# EAGLE design BEP31_Test_Interface4 (EAGLE 6.4)

## Sheet 1 of 5
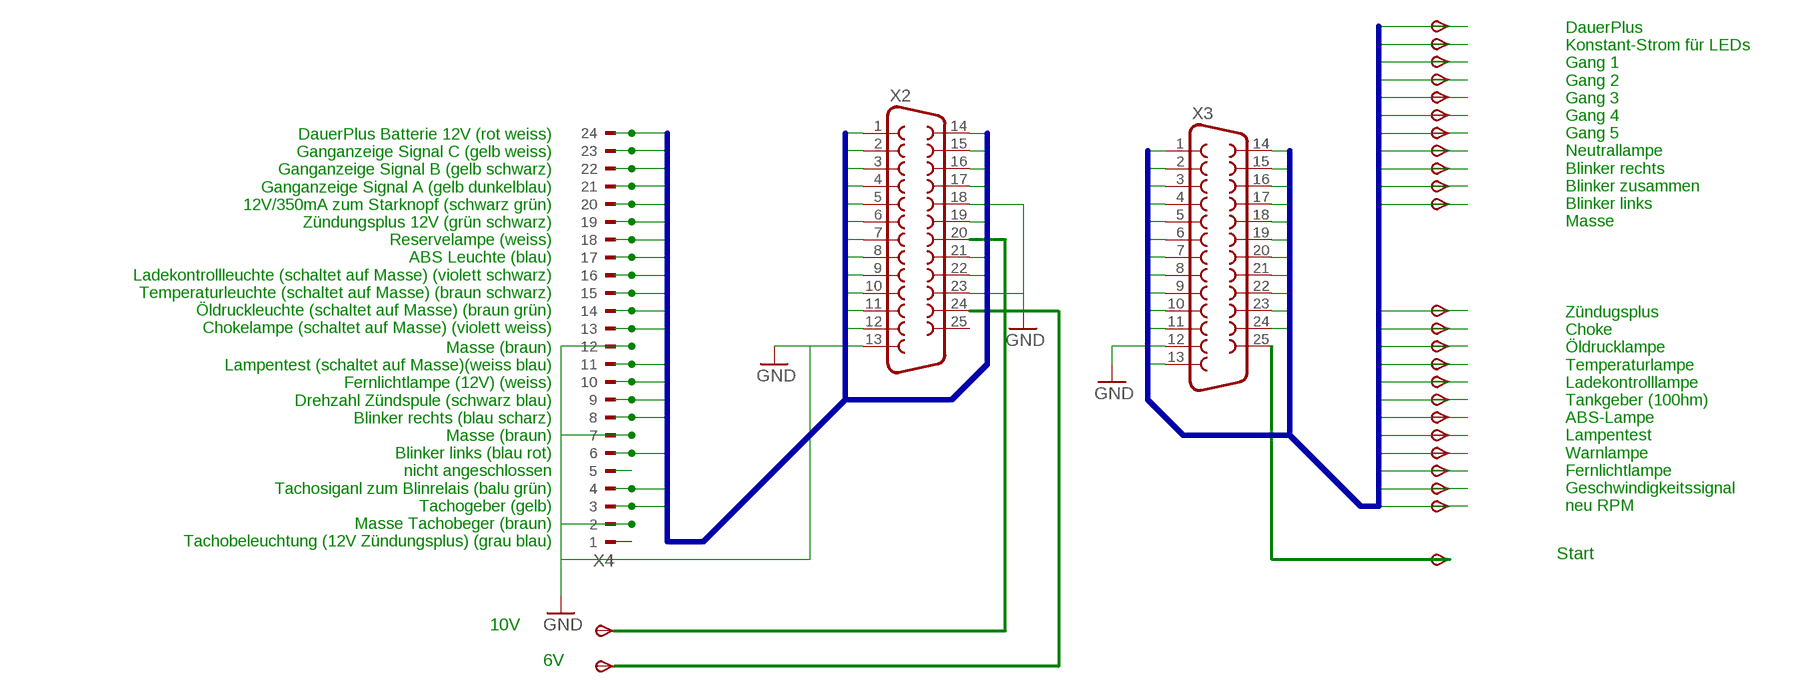
[diagram p0: schematic, sheet 1]

### Parts
TP1  TPSFEDERPIN  [1,36ID]
TP2  TPSFEDERPIN  [1,36ID]
TP3  TPSFEDERPIN  [1,36ID]
TP4  TPSFEDERPIN  [1,36ID]
TP5  TPSFEDERPIN  [1,36ID]
TP6  TPSFEDERPIN  [1,36ID]
TP7  TPSFEDERPIN  [1,36ID]
TP8  TPSFEDERPIN  [1,36ID]
TP9  TPSFEDERPIN  [1,36ID]
TP10  TPSFEDERPIN  [1,36ID]
TP11  TPSFEDERPIN  [1,36ID]
TP12  TPSFEDERPIN  [1,36ID]
TP13  TPSFEDERPIN  [1,36ID]
TP14  TPSFEDERPIN  [1,36ID]
TP15_10V  TPSFEDERPIN  [1,36ID]
TP16  TPSFEDERPIN  [1,36ID]
TP17  TPSFEDERPIN  [1,36ID]
TP18  TPSFEDERPIN  [1,36ID]
TP19  TPSFEDERPIN  [1,36ID]
TP20_6V  TPSFEDERPIN  [1,36ID]
TP21  TPSFEDERPIN  [1,36ID]
TP22  TPSFEDERPIN  [1,36ID]
TP23  TPSFEDERPIN  [1,36ID]
TP24  TPSFEDERPIN  [1,36ID]
TP25  TPSFEDERPIN  [1,36ID]
TP26  TPSFEDERPIN  [1,36ID]
X2  F25H  [F25H]
X3  F25H  [F25H]
X4  CON_BMWTESTPINS  [24-TESTPIN_1,36ID]

### Nets
BMW1: X2.1 X4.P24
BMW2: X2.2 X4.P23
BMW3: X2.3 X4.P22
BMW4: X2.4 X4.P21
BMW5: X2.5 X4.P20
BMW6: X2.6 X4.P19
BMW7: X2.7 X4.P18
BMW8: X2.8 X4.P17
BMW9: X2.9 X4.P16
BMW10: X2.10 X4.P15
BMW11: X2.11 X4.P14
BMW12: X2.12 X4.P13
BMW14: X2.14 X4.P11
BMW15: X2.15 X4.P10
BMW16: X2.16 X4.P9
BMW17: X2.17 X4.P8
BMW19: X2.19 X4.P6
BMW21: X2.21 X4.P4
BMW22: X2.22 X4.P3
BMW24: TP15_10V.P$1(PP) X2.20
GND: X2.13 X2.18 X2.23 X3.12 X4.P2 X4.P7 X4.P12
N$1: X4.P5
N$97: TP14.P$1(PP) X3.25
N$100: TP20_6V.P$1(PP) X2.24
WAGO1: TP1.P$1(PP) X3.1
WAGO2: TP2.P$1(PP) X3.2
WAGO3: TP3.P$1(PP) X3.3
WAGO4: TP4.P$1(PP) X3.4
WAGO5: TP5.P$1(PP) X3.5
WAGO6: TP6.P$1(PP) X3.6
WAGO7: TP7.P$1(PP) X3.7
WAGO8: TP8.P$1(PP) X3.8
WAGO9: TP9.P$1(PP) X3.9
WAGO10: TP10.P$1(PP) X3.10
WAGO11: TP11.P$1(PP) X3.11
WAGO13: TP12.P$1(PP) X3.13
WAGO14: TP16.P$1(PP) X3.14
WAGO15: TP17.P$1(PP) X3.15
WAGO16: TP18.P$1(PP) X3.16
WAGO17: TP19.P$1(PP) X3.17
WAGO18: TP21.P$1(PP) X3.18
WAGO19: TP22.P$1(PP) X3.19
WAGO20: TP23.P$1(PP) X3.20
WAGO21: TP24.P$1(PP) X3.21
WAGO22: TP25.P$1(PP) X3.22
WAGO23: TP26.P$1(PP) X3.23
WAGO24: TP13.P$1(PP) X3.24
Unconnected: X2.25 X4.P1

### Buses
BMW[1..24]
WAGO[1..24]

### Notes on the sheet
- DauerPlus
  Konstant-Strom für LEDs
  Gang 1
  Gang 2
  Gang 3
  Gang 4
  Gang 5
  Neutrallampe
  Blinker rechts
  Blinker zusammen
  Blinker links
  Masse
- DauerPlus Batterie 12V (rot weiss)
  Ganganzeige Signal C (gelb weiss)
  Ganganzeige Signal B (gelb schwarz)
  Ganganzeige Signal A (gelb dunkelblau)
  12V/350mA zum Starknopf (schwarz grün)
  Zündungsplus 12V (grün schwarz)
  Reservelampe (weiss)
  ABS Leuchte (blau)
  Ladekontrollleuchte (schaltet auf Masse) (violett schwarz)
  Temperaturleuchte (schaltet auf Masse) (braun schwarz)
  Öldruckleuchte (schaltet auf Masse) (braun grün)
  Chokelampe (schaltet auf Masse) (violett weiss)
- Zündugsplus
  Choke
  Öldrucklampe
  Temperaturlampe
  Ladekontrolllampe
  Tankgeber (100hm)
  ABS-Lampe
  Lampentest
  Warnlampe
  Fernlichtlampe
  Geschwindigkeitssignal
  neu RPM
- Masse (braun)
  Lampentest (schaltet auf Masse)(weiss blau)
  Fernlichtlampe (12V) (weiss)
  Drehzahl Zündspule (schwarz blau)
  Blinker rechts (blau scharz)
  Masse (braun)
  Blinker links (blau rot)
  nicht angeschlossen
  Tachosiganl zum Blinrelais (balu grün)
  Tachogeber (gelb)
  Masse Tachobeger (braun)
  Tachobeleuchtung (12V Zündungsplus) (grau blau)
- Start
- 10V
- 6V

## Sheet 2 of 5
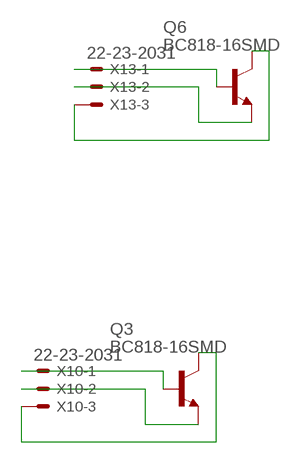
[diagram p1: schematic, sheet 2]

### Parts
Q3  BC818-16SMD  [SOT23-BEC]
Q6  BC818-16SMD  [SOT23-BEC]
X10  22-23-2031  [22-23-2031]
X13  22-23-2031  [22-23-2031]

### Nets
N$144: Q3.B X10.1
N$145: Q3.E X10.2
N$146: Q3.C X10.3
N$154: Q6.B X13.1
N$155: Q6.E X13.2
N$156: Q6.C X13.3

## Sheet 3 of 5
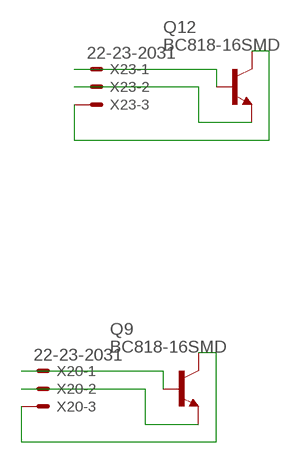
[diagram p2: schematic, sheet 3]

### Parts
Q9  BC818-16SMD  [SOT23-BEC]
Q12  BC818-16SMD  [SOT23-BEC]
X20  22-23-2031  [22-23-2031]
X23  22-23-2031  [22-23-2031]

### Nets
N$204: Q9.B X20.1
N$205: Q9.E X20.2
N$206: Q9.C X20.3
N$214: Q12.B X23.1
N$215: Q12.E X23.2
N$216: Q12.C X23.3

## Sheet 4 of 5
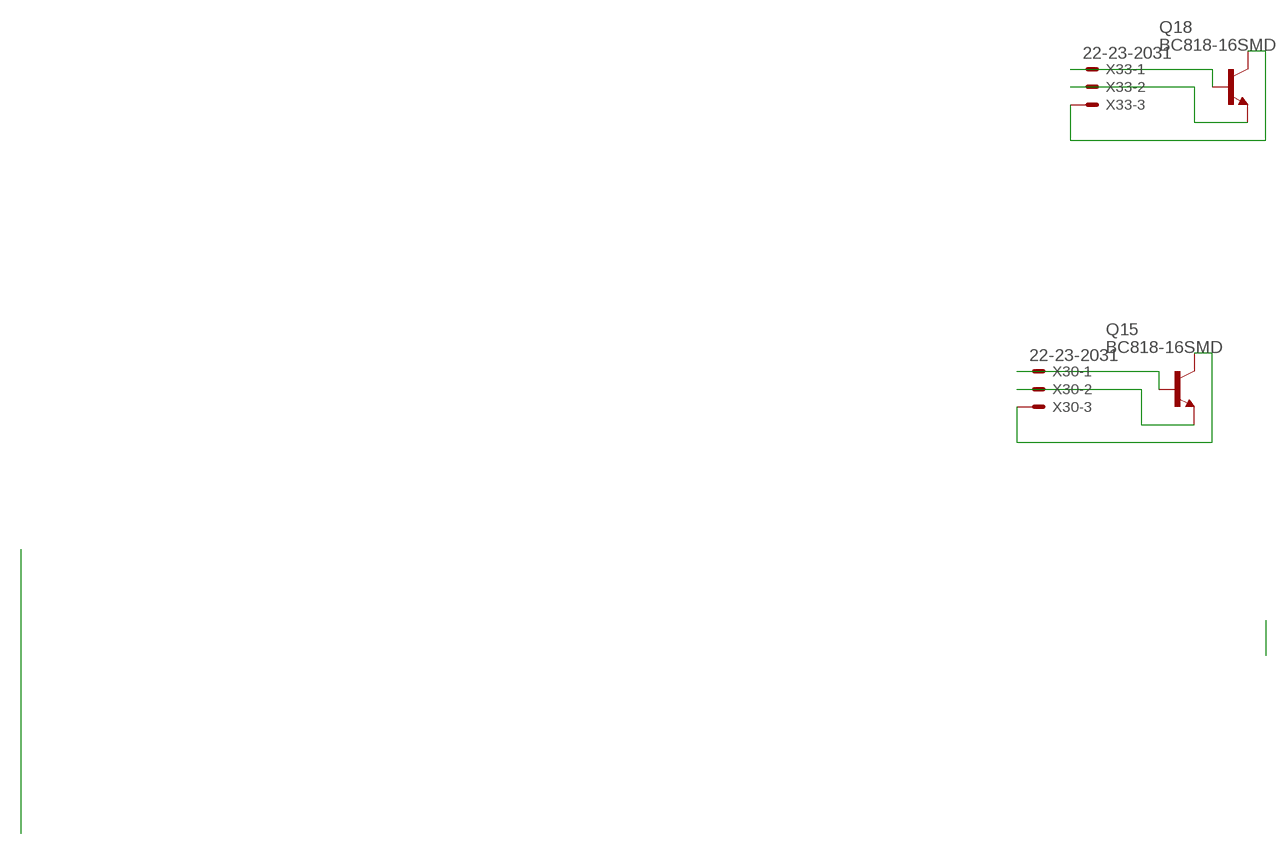
[diagram p3: schematic, sheet 4]

### Parts
Q15  BC818-16SMD  [SOT23-BEC]
Q18  BC818-16SMD  [SOT23-BEC]
X30  22-23-2031  [22-23-2031]
X33  22-23-2031  [22-23-2031]

### Nets
N$264: Q15.B X30.1
N$265: Q15.E X30.2
N$266: Q15.C X30.3
N$274: Q18.B X33.1
N$275: Q18.E X33.2
N$276: Q18.C X33.3

## Sheet 5 of 5
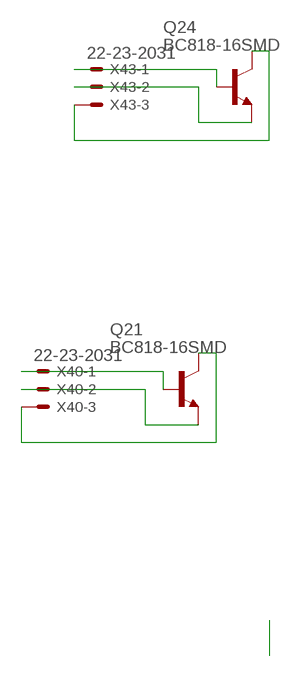
[diagram p4: schematic, sheet 5]

### Parts
Q21  BC818-16SMD  [SOT23-BEC]
Q24  BC818-16SMD  [SOT23-BEC]
X40  22-23-2031  [22-23-2031]
X43  22-23-2031  [22-23-2031]

### Nets
N$324: Q21.B X40.1
N$325: Q21.E X40.2
N$326: Q21.C X40.3
N$334: Q24.B X43.1
N$335: Q24.E X43.2
N$336: Q24.C X43.3

## Library data of the parts
Q3 Q6 Q9 Q12 Q15 Q18 Q21 Q24 = transistor-npn:BC818*: NPN Transistor
TP1-TP14 TP15_10V TP16-TP19 TP20_6V TP21-TP26 = testpin_BMW:TPS: TEST PIN
X2 X3 = con-subd:F25: SUB-D; OC_FARNELL: unknown; OC_NEWARK: unknown
X4 = con_BMW:CON_BMW: BMW CONNECTOR
X10 X13 X20 X23 X30 X33 X40 X43 = con-molex:22-23-2031: .100" (2.54mm) Center Header - 3 Pin; MF: MOLEX; MPN: 22-23-2031; OC_FARNELL: 1462950; OC_NEWARK: 30C0862

## Board
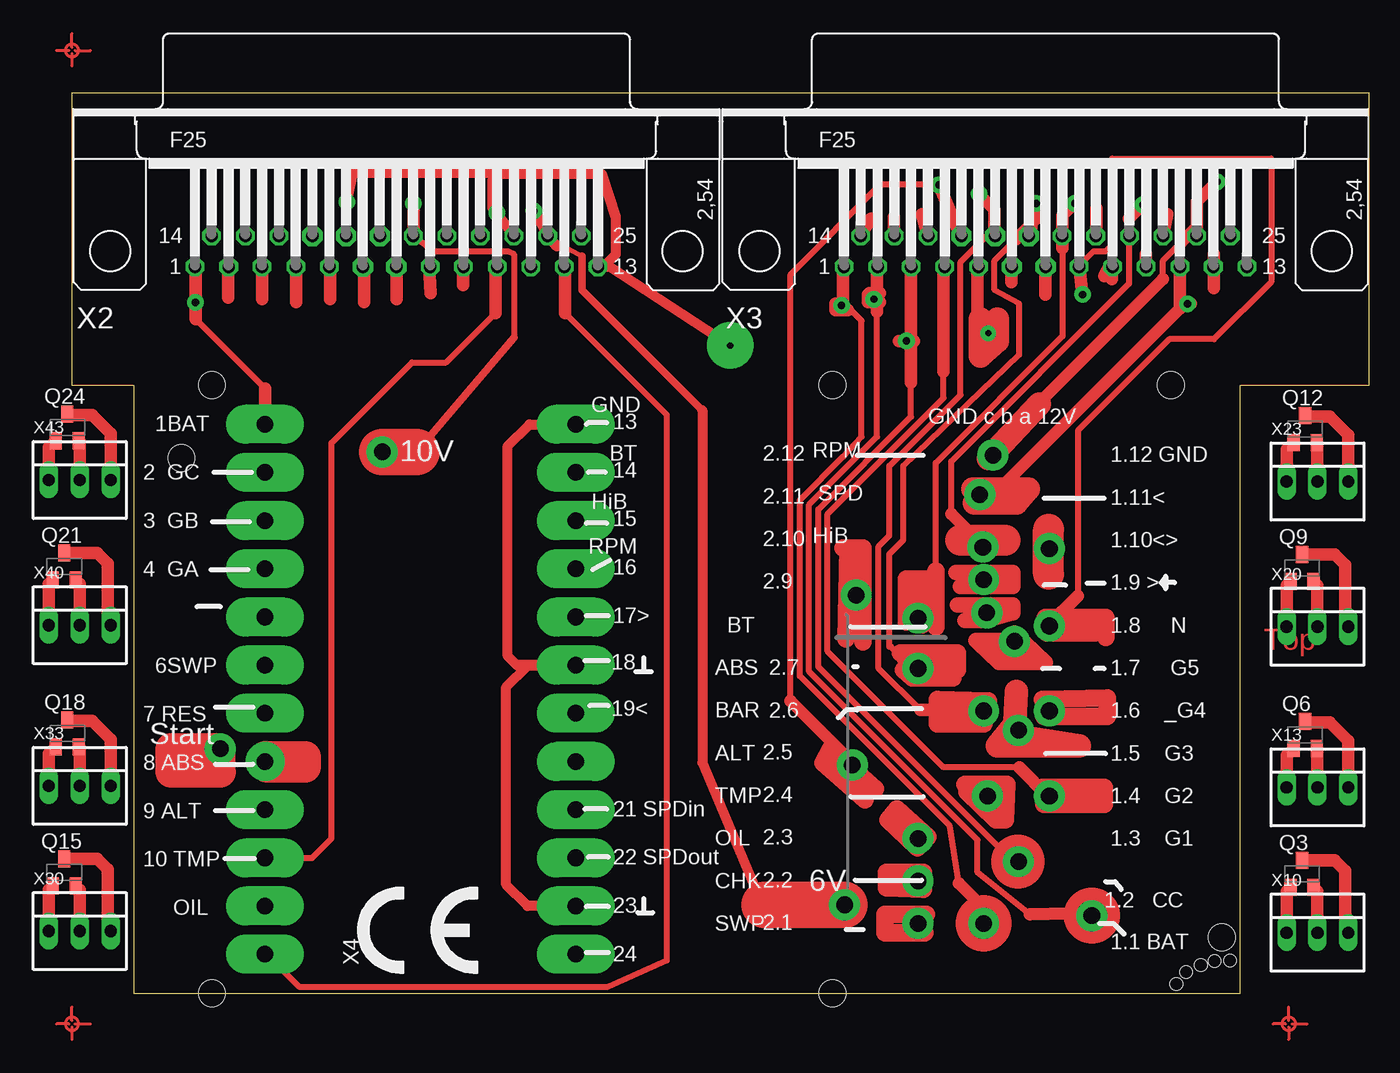
[diagram p5: board, top side]
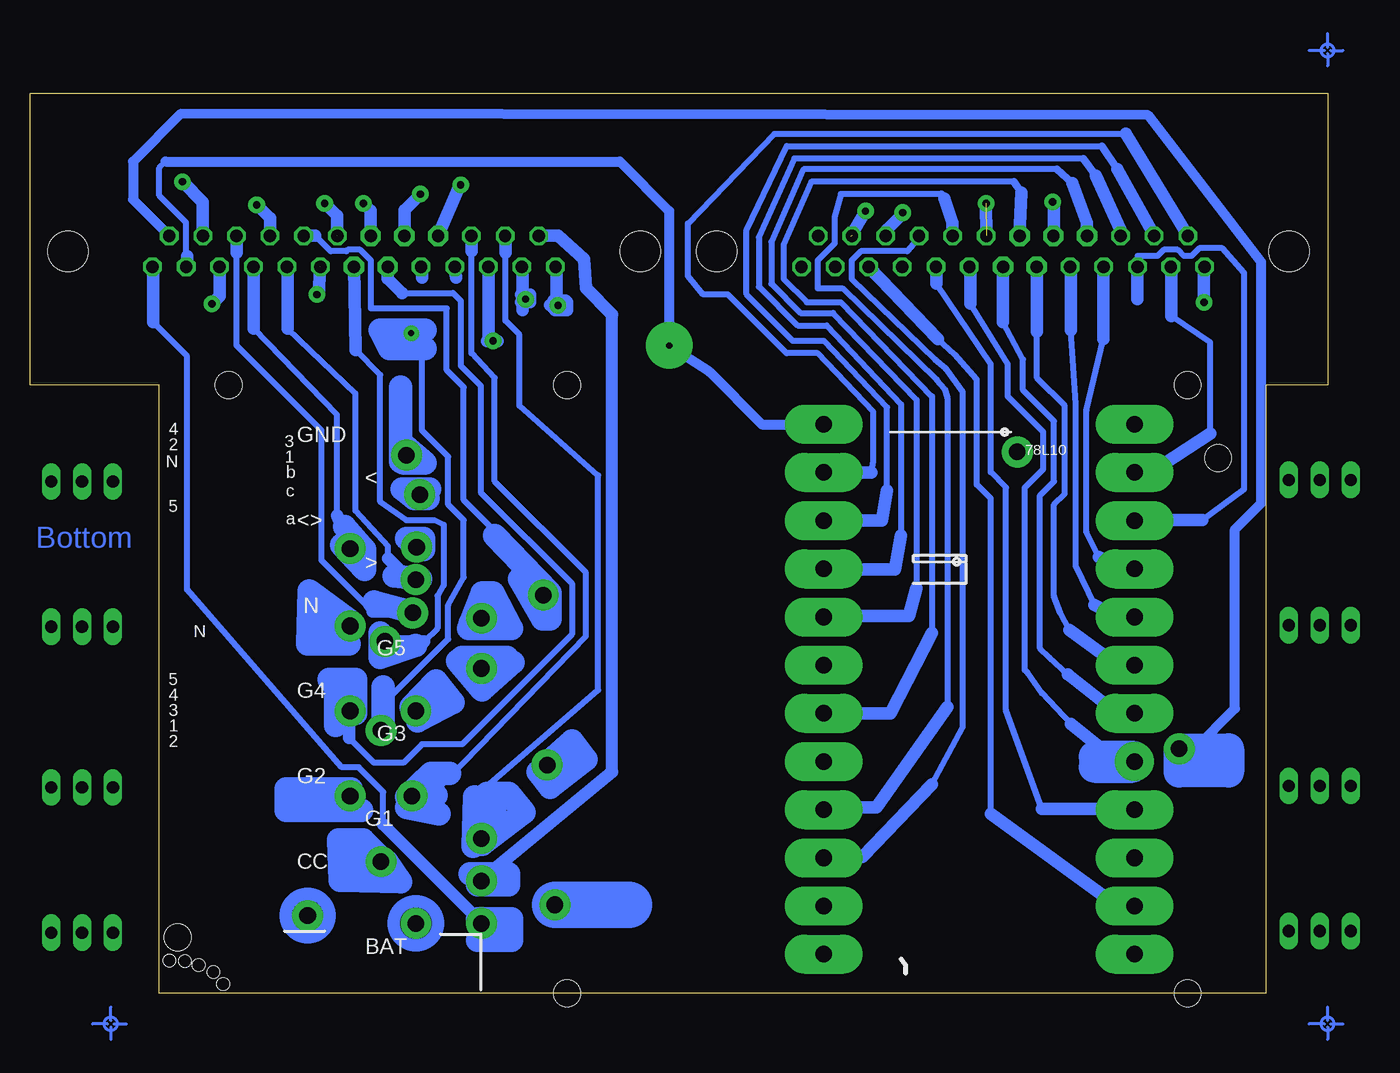
[diagram p6: board, bottom side, seen from below]

Size 106.6 x 74 mm. Coordinates in mm from the lower left corner, seen from the top.
Outline: 106.6,74 0,74 0,50 5.08,50 5.08,0 96,0 96,50 106.6,50 106.6,74
Copper layers (1*16): Top 0.035mm / dielectric 1.5mm / Bottom 0.035mm
Design rules "default *": minimum track width 20mil, minimum drill 20mil, track to track 10mil, track to pad 10mil, pad to pad 10mil, via to via 10mil, smd to smd 8mil, copper to edge 8mil, drill to drill 8mil, minimum pad ring 10mil, minimum via ring 15mil, stop-mask expansion 4mil, vias tented up to drill 0mil, thermal gap 10mil
Holes 1.02 mm at 95.19,2.71 93.92,2.64 92.77,2.33 91.57,1.75 90.76,0.77
Holes 2.18 mm at 94.5,4.6 9,44 11.5,50 62.5,50 11.5,0 62.5,0 90.3,50 94.5,4.6
tRestrict: area 62.5,58.1 to 92.2,63.5
bRestrict: area 9.1,46.4 to 38.2,60.4; area 11.2,61.6 to 20.1,64; area 19,64.3 to 37.2,67.3; area 62.4,58.1 to 92.2,63.7

### Footprints (pad centres in the part's own frame; a part is rotated, then mirrored left to right if it is on the bottom)
SOT23-BEC = smd 1 x 1.4: B -0.95,-1.1; C 0,1.1; E 0.95,-1.1
1,36ID = drill 1.36 pad 2.54: P$1 0,0
F25H = drill 1.016 octagon: 1 -16.561,-1.27; 2 -13.792,-1.27; 3 -11.049,-1.27; 4 -8.28,-1.27; 5 -5.512,-1.27; 8 2.769,-1.27; 9 5.512,-1.27; 10 8.28,-1.27; 11 11.049,-1.27; 12 13.792,-1.27; 13 16.561,-1.27; 14 -15.189,1.27; 15 -12.421,1.27; 16 -9.652,1.27; 20 1.372,1.27; 21 4.14,1.27; 22 6.909,1.27; 23 9.652,1.27; 24 12.421,1.27; 25 15.189,1.27 | drill 1.016 pad 1.67 octagon: 6 -2.769,-1.27; 7 0,-1.27; 17 -6.909,1.27; 18 -4.14,1.27; 19 -1.372,1.27 | hole 3.302: -23.52,0; 23.52,0
24-TESTPIN_1,36ID = drill 1.36 pad 3.2 long: P1 -21.78,-12.76; P2 -17.82,-12.76; P3 -13.86,-12.76; P4 -9.9,-12.76; P5 -5.94,-12.76; P6 -1.98,-12.76; P7 1.98,-12.76; P8 5.94,-12.76; P9 9.9,-12.76; P10 13.86,-12.76; P11 17.82,-12.76; P12 21.78,-12.76; P13 -21.78,12.76; P14 -17.82,12.76; P15 -13.86,12.76; P16 -9.9,12.76; P18 -1.98,12.76; P19 1.98,12.76; P20 5.94,12.76; P21 9.9,12.76; P22 13.86,12.76; P23 17.82,12.76; P24 21.78,12.76 | drill 1.36 pad 3.2: P17 -5.94,12.76
22-23-2031 = drill 1 long: 1 -2.54,0; 2 0,0; 3 2.54,0

### Placement (x,y rotation side)
Q3  101.09,9.82 0 top
Q6  101.35,21.25 0 top
Q9  101.09,34.97 0 top
Q12  101.35,46.4 0 top
Q15  -0.64,9.95 0 top
Q18  -0.38,21.38 0 top
Q21  -0.64,35.09 0 top
Q24  -0.38,46.52 0 top
TP1  74.93,5.76 0 bottom
TP2  83.82,6.39 0 bottom
TP3  77.79,10.84 0 bottom
TP4  80.33,16.23 0 bottom
TP5  77.79,21.63 0 bottom
TP6  80.33,23.22 0 bottom
TP7  77.47,28.93 0 bottom
TP8  80.33,30.2 0 bottom
TP9  74.93,34.01 0 bottom
TP10  80.33,36.55 0 bottom
TP11  74.61,41 0 bottom
TP12  69.53,5.76 0 bottom
TP13  75.69,44.24 0 bottom
TP14  12.19,20.11 0 top
TP15_10V  25.5,44.5 0 top
TP16  69.53,9.25 0 bottom
TP17  69.53,12.74 0 bottom
TP18  75.25,16.23 0 bottom
TP19  64.14,18.77 0 bottom
TP20_6V  63.5,7.28 0 top
TP21  74.93,23.22 0 bottom
TP22  69.53,26.71 0 bottom
TP23  69.53,30.84 0 bottom
TP24  64.45,32.74 0 bottom
TP25  74.87,36.68 0 bottom
TP26  75.18,31.28 0 bottom
U$1  [CE_10.00]  23.37,1.56 0 top
X2  26.67,61 0 top
X3  80.01,61 0 top
X4  28.64,25 90 top
X10  102.36,4.99 0 top
X13  102.36,16.93 0 top
X20  102.36,30.14 0 top
X23  102.36,42.08 0 top
X30  0.64,5.12 0 top
X33  0.64,17.06 0 top
X40  0.64,30.27 0 top
X43  0.64,42.2 0 top

### Tracks (layer width: path | path; a pad name or v marks a point on that pad's centre or on a via)
BMW1  (via drill 0.6)
  Top 0.508: 15.88,49.7 10.16,55.41 | 10.16,59.73 X2.1
  Top 1.016: 10.16,55.41 v10.16,56.81 10.16,59.73 | X4.P24 15.88,49.7
  Bottom 1.016: 10.16,59.73 v10.16,56.81
BMW2
  Bottom 0.508: 12.83,55.67 9.65,53.51 9.65,46.01 | 14.48,42.84 15.88,42.84 X4.P23 | 12.83,59.73 X2.2
  Bottom 1.016: 12.83,55.67 12.83,59.73 | 14.48,42.84 9.65,46.01
BMW3
  Bottom 0.508: 15.62,57.06 15.62,60.62 13.97,60.62 13.46,61.13 12.32,61.13 11.81,60.62 11.18,60.62 10.54,61.25 8.64,61.25 6.86,59.22 6.86,41.44 10.29,38.9 | 15.88,38.9 X4.P22
  Bottom 1.016: 15.62,57.06 X2.3 | 15.88,38.9 10.29,38.9
BMW4
  Bottom 0.508: 18.41,53.76 19.81,47.92 19.81,37.89 18.8,35.85 | 17.4,34.97 15.88,34.97 X4.P21 | 18.41,59.73 X2.4
  Bottom 1.016: 18.41,53.76 18.41,59.73 | 17.4,34.97 18.8,35.85
BMW5
  Bottom 0.508: 19.18,31.92 20.7,35.09 20.7,48.43 21.08,54.52 | 17.4,31.03 15.88,31.03 X4.P20 | 21.08,59.73 X2.5
  Bottom 1.016: 21.08,54.52 21.08,59.73 | 17.4,31.03 19.18,31.92
BMW6
  Bottom 0.508: 23.88,54.4 23.88,50.59 21.59,48.3 21.59,41.06 22.48,40.17 22.48,32.68 21.97,31.28 21.21,29.88 | 17.4,27.09 15.88,27.09 X4.P19 | 23.88,59.73 X2.6
  Bottom 1.016: 23.88,54.4 23.88,59.73 | 17.4,27.09 21.21,29.88
BMW7
  Bottom 0.508: 26.67,55.16 25.02,52.11 25.02,49.57 22.48,47.03 22.48,42.08 23.62,40.93 23.62,28.36 22.86,27.6 21.34,26.2 | 17.27,23.03 X4.P18
  Bottom 1.016: 26.67,55.16 X2.7 | 17.27,23.03 21.34,26.2
BMW8
  Bottom 0.508: 29.34,56.68 26.29,51.73 26.29,49.06 23.37,46.14 23.37,43.09 24.89,41.57 24.89,26.58 24.64,26.33 23.5,24.68 21.08,22.14 | 17.27,19.09 15.88,19.09 X4.P17 | 29.34,59.73 X2.8
  Bottom 1.016: 29.34,56.68 29.34,59.73 | 17.27,19.09 21.08,22.14
  Bottom 2.54: 15.88,19.09 15.88,19.47 19.18,19.47 19.18,18.58 16,18.58 16,18.71
BMW9
  Bottom 0.508: 32.13,58.33 27.69,51.73 27.69,42.84 26.42,41.57 26.42,23.28 23.5,15.15 | 17.27,15.15 15.88,15.15 X4.P16 | 32.13,59.73 X2.9
  Bottom 1.016: 32.13,58.33 32.13,59.73 | 17.27,15.15 23.5,15.15
BMW10
  Top 0.508: X4.P15 19.74,11.14 21.34,12.74 21.34,45.25 27.94,51.86 30.73,51.86 34.8,55.92 | 34.8,59.58 X2.10
  Top 1.016: 34.8,55.92 34.8,59.58
BMW11
  Bottom 0.508: 32,53.76 30.61,52.49 28.83,50.46 28.83,41.82 27.69,40.68 27.69,14.77 | 17.4,7.28 15.88,7.28 X4.P14
  Bottom 1.016: 32,53.76 X2.11 | 17.4,7.28 27.69,14.77
BMW12
  Top 0.508: 40.51,55.92 48.9,47.54 48.9,2.71 44.07,0.55 18.67,0.55 15.88,3.34 X4.P13 | 40.51,59.73 X2.12
  Top 1.016: 40.51,55.92 40.51,59.73
BMW14
  Bottom 0.508: 37.48,42.82 37.34,43.73 37.34,47.79 41.91,52.62 44.45,52.62 49.28,57.44 51.31,57.44 52.58,58.97 52.58,63.29 45.47,70.65 16.56,70.65
  Bottom 1.016: X4.P11 37.48,42.82 | 16.56,70.65 X2.14
BMW15
  Bottom 0.508: 36.2,41.31 36.2,48.17 41.4,53.63 43.94,53.63 47.75,57.44 47.75,62.78 44.45,69.64 18.54,69.64
  Bottom 0.61: 18.54,69.64 17.27,67.73
  Bottom 1.016: X4.P10 36.62,38.86 36.2,41.31 | 17.27,67.73 X2.15
BMW16
  Bottom 0.508: 20.07,68.62 43.81,68.62 46.74,62.14 46.74,58.08 43.56,54.9 41.15,54.9 35.05,48.43 35.05,37.63 | 41.33,34.84 X4.P9
  Bottom 0.61: 19.05,67.22 20.07,68.62
  Bottom 1.016: X2.16 17.02,62.78 19.05,67.22 | 35.05,37.63 35.56,34.84 41.33,34.84
BMW17
  Bottom 0.508: 22.23,67.73 43.05,67.73 45.72,61.76 45.72,58.33 43.31,55.92 40.64,55.92 33.78,48.81 33.78,33.31 | 41.4,31.03 41.78,30.65 41.69,30.65 X4.P8
  Bottom 0.61: 20.95,66.59 22.23,67.73
  Bottom 1.016: X2.17 19.76,63.36 20.95,66.59 | 33.78,33.31 34.42,31.03 41.4,31.03
BMW19
  Bottom 0.508: 25.78,66.72 42.42,66.72 44.7,61.51 44.7,58.71 42.8,56.81 40.01,56.81 32.51,49.06 32.51,29.63 | 41.39,23.03 X4.P6
  Bottom 0.61: 25.15,65.83 25.78,66.72
  Bottom 1.016: X2.19 25.3,63.18 25.15,65.83 | 32.51,29.63 35.94,23.03 41.39,23.03
BMW21
  Bottom 0.508: 31.75,65.7 40.01,65.7 40.51,63.79 40.51,61.64 41.91,60.24 41.91,57.95 39.88,57.95 32.13,50.46 31.5,49.7 31.24,48.94 31.24,23.54 | 41.22,15.28 X4.P4
  Bottom 0.61: 31.5,65.32 31.75,65.7
  Bottom 1.016: X2.21 30.81,63.36 31.5,65.32 | 31.24,23.54 37.08,15.28 41.22,15.28
BMW22
  Bottom 0.406: 33.53,62.27 33.53,62.14
  Bottom 0.508: 32.51,17.18 29.97,21.88 29.97,49.44 31.37,51.35 32.26,52.11 39.12,58.71 39.12,60.24 38.35,61 34.54,61 33.53,62.14 | 33.53,62.27 X2.22
  Bottom 1.016: 32.51,17.18 38.23,11.22 X4.P3
BMW24  (via drill 0.6)  (1 unrouted)
  Top 0.508: 28.07,62.27 28.19,62.14 29.72,61 35.81,61 36.32,60.75 36.32,53.89
  Top 0.61: 28.33,44.5 36.32,53.89
  Top 1.016: v28.07,64.94 28.07,62.27
  Top 3.81: TP15_10V.P$1 28.33,44.5
  Bottom 1.016: 28.04,62.3 v28.07,64.94
GND  (via drill 0.51 pad 3.81)
  Top 0.813: X4.P2 37.44,7.18 35.69,8.93 35.69,25.19 37.47,26.96 41.38,26.96 X4.P7 36.56,26.98 35.81,27.73 35.81,45 37.59,46.78 X4.P12 | 34.54,66.84 34.8,67.35 43.56,67.35 44.7,63.79 44.7,60.75 43.69,59.73 X2.13 44.2,59.73 v54.1,53.25 | 34.54,66.84 34.54,64.56 X2.23 | X2.18 22.53,64.73 23.11,67.48 35.05,67.48 34.54,66.84
  Bottom 0.508: X3.12 93.8,63.36 96.01,65.57 96.01,67.86 95.5,68.37
  Bottom 0.813: X4.P12 46.48,46.78 50.8,51.09 v54.1,53.25 54.1,64.3 58.17,68.37 95.5,68.37
N$2  (via drill 0.6)
  other vias: 3.15,61
N$3  (via drill 0.6)
  other vias: 50.19,61
N$4  (via drill 0.6)
  other vias: 56.49,61
N$5  (via drill 0.6)
  other vias: 103.53,61
N$6
  Top 0.508: 73.15,62.27 73.03,62.27
  Top 1.016: 73.03,62.27 71.25,66.46
N$7
  Top 0.508: 78.74,62.27 78.87,62.27
  Top 1.016: 78.87,62.27 78.87,64.81
N$8  (1 unrouted)
  Top 0.254: 0.25,-2.5 1.52,-2.5
  Bottom 0.254: 0.25,-2.5 1.52,-2.5
N$9  (1 unrouted)
  Top 0.254: 0,-2.25 0,-1.1
  Bottom 0.254: 0,-2.25 0,-1.1
N$10  (1 unrouted)
  Top 0.254: 0,-2.75 0,-3.77
  Bottom 0.254: 0,-2.75 0,-3.77
N$11  (1 unrouted)
  Top 0.254: -0.25,-2.5 -1.27,-2.5
  Bottom 0.254: -0.25,-2.5 -1.27,-2.5
N$12  (1 unrouted)
  Top 0.254: 100.25,-2.5 101.52,-2.5
  Bottom 0.254: 100.25,-2.5 101.52,-2.5
N$13  (1 unrouted)
  Top 0.254: 100,-2.25 100,-1.1
  Bottom 0.254: 100,-2.25 100,-1.1
N$14  (1 unrouted)
  Top 0.254: 100,-2.75 100,-3.77
  Bottom 0.254: 100,-2.75 100,-3.77
N$15  (1 unrouted)
  Top 0.254: 99.75,-2.5 98.73,-2.5
  Bottom 0.254: 99.75,-2.5 98.73,-2.5
N$16  (1 unrouted)
  Top 0.254: 0.25,77.5 1.52,77.5
  Bottom 0.254: 0.25,77.5 1.52,77.5
N$17  (1 unrouted)
  Top 0.254: 0,77.75 0,78.9
  Bottom 0.254: 0,77.75 0,78.9
N$18  (1 unrouted)
  Top 0.254: 0,77.25 0,76.23
  Bottom 0.254: 0,77.25 0,76.23
N$19  (1 unrouted)
  Top 0.254: -0.25,77.5 -1.27,77.5
  Bottom 0.254: -0.25,77.5 -1.27,77.5
N$20  (1 unrouted)
  Top 1.016: 82.8,59.73 83.06,57.44
  Bottom 1.016: 82.8,59.86 82.8,59.73 82.93,57.32
N$21
  Top 1.016: 85.47,59.73 85.47,58.71
N$22
  Top 1.016: 85.34,59.86 84.84,58.97
N$23
  Top 1.016: 67.56,62.27 67.56,63.79
N$24
  Top 1.016: 64.77,62.27 65.66,63.67
N$25
  Top 1.016: 84.2,62.27 84.2,64.56
N$26
  Top 1.016: 88.27,59.73 88.27,60.75
N$27
  Top 1.016: 77.22,59.73 77.22,58.46
N$28
  Bottom 1.016: 63.37,59.73 63.37,56.81
N$29
  Bottom 1.016: 66.17,59.73 66.17,56.17
N$30
  Bottom 1.016: 71.75,59.73 71.63,58.84
N$31
  Bottom 1.016: 74.42,59.73 74.42,58.84
N$32
  Top 1.016: 12.83,59.73 12.83,57.19
N$33
  Top 1.016: 15.62,59.6 15.62,57.06
N$34
  Top 1.016: 18.41,59.73 18.41,56.81
N$35
  Top 1.016: 21.21,59.73 21.21,57.06
N$36
  Top 1.016: 24,59.73 24,56.81
N$37
  Top 1.016: 26.67,59.6 26.67,57.06
N$38
  Top 1.016: 29.34,59.73 29.46,57.57
N$39
  Top 1.016: 32.13,59.73 32.13,58.21
N$41
  Top 1.422: 66.04,16.8 62.36,20.11 61.72,18.96 65.15,15.91
N$42
  Top 1.422: 79.76,16.93 84.84,16.93 84.84,15.53 79.88,15.53
N$43
  Top 1.422: 70.36,12.87 67.82,15.15 67.06,14.26 69.47,11.98
N$44
  Top 1.422: 69.98,9.95 66.93,9.95 66.93,8.68 69.98,8.55
N$45
  Top 1.422: 70.23,6.52 66.8,6.52 66.8,4.99 70.1,4.99
N$46
  Top 1.422: 79.88,22.77 85.09,22.77 85.09,24.3 79.76,24.17
N$47
  Top 1.422: 75.31,24.04 71.12,24.17 71.12,22.14 74.93,22.14
N$48
  Top 1.422: 80.01,30.9 84.96,30.9 84.96,29.25
N$49
  Top 1.422: 80.14,29.63 84.07,29.63
N$50
  Top 1.422: 73.41,17.18 76.83,17.18 76.71,14.26 75.95,14.26 73.53,16.55
N$51
  Top 1.422: 68.07,27.98 72.77,27.98 72.77,26.58 68.33,26.58 69.09,25.95 72.39,25.95
N$52
  Top 1.422: 68.58,30.52 68.58,34.08 70.1,34.08
N$53
  Top 1.422: 69.85,30.27 69.85,33.95
N$54
  Top 1.422: 65.02,28.87 65.02,36.62 63.75,36.62 | 63.75,36.62 63.37,36.62 | 63.75,36.62 63.63,29.12
N$55
  Top 2.54: 80.26,34.46 80.26,38.14
N$56
  Top 2.54: 73.03,37.25 76.71,37.25
N$57
  Top 1.27: 72.64,34.58 77.34,34.58 77.34,33.44 73.03,33.44
N$58
  Top 1.27: 72.77,31.92 77.34,31.92 77.34,31.28 75.18,30.65 73.41,30.65
N$59
  Top 1.27: 77.47,29.63 80.01,27.22 76.2,27.22 74.42,28.87 78.36,28.11
N$60
  Top 1.27: 74.3,29 76.96,29
N$61
  Bottom 1.93: 75.44,16.3 73.28,16.3
N$63
  Bottom 1.93: 73.03,14.77 75.69,15.28
N$64
  Bottom 1.93: 70.48,9.82 67.31,9.82 67.31,8.93 69.85,8.93
N$65
  Bottom 1.93: 77.85,11.22 79.25,12.61 81.28,12.61 81.15,9.31 76.2,9.18 77.34,10.84 79.12,10.96
N$67
  Bottom 1.93: 69.47,12.23 66.04,14.9 67.31,16.42 69.09,16.42 68.07,14.01
N$70
  Bottom 1.93: 70.23,12.11 70.1,16.17
N$71
  Bottom 1.93: 64.26,18.84 62.1,20.74 60.96,19.22 63.88,16.93 64.9,18.2
N$72
  Bottom 1.93: 79.88,23.03 79.88,25.82 82.04,25.82 81.53,25.31 81.53,22.01
N$73
  Bottom 1.93: 75.31,23.54 73.28,25.69 71.88,23.92 74.8,22.39
N$74
  Bottom 1.93: 77.6,21.5 77.6,25.19
N$76
  Bottom 1.93: 80.14,11.6 80.14,10.07
N$77
  Bottom 1.93: 80.26,16.8 85.6,16.8 85.6,15.03 79.38,15.03
N$78
  Bottom 1.93: 74.93,31.28 78.36,32.17
N$79
  Bottom 1.93: 80.39,30.65 83.69,33.06 83.82,28.74 80.39,28.74 82.68,30.52
N$80
  Bottom 1.93: 77.85,29.63 77.85,27.6 74.93,28.61
N$81
  Bottom 1.93: 80.77,38.39 79.12,36.49 79.12,34.84 81.03,36.87
N$82
  Bottom 1.93: 74.55,34.08 76.71,34.33
N$83
  Bottom 1.93: 74.3,36.49 74.3,37.38 75.69,37.38
N$84
  Bottom 1.93: 67.44,27.6 71.12,27.6 71.5,27.34 69.47,24.93 66.93,27.22
N$85
  Bottom 1.93: 70.61,30.01 67.06,30.01 68.58,32.93 69.47,32.93 70.48,30.39
N$86
  Bottom 1.93: 66.42,34.08 64.52,30.77 63.88,30.77 63.88,32.93 68.45,37.63
N$87
  Bottom 1.93: 72.14,18.07 73.66,18.07 75.69,16.17
N$88
  Bottom 1.93: 73.79,41.44 76.07,41.44 75.06,40.68 73.91,40.68
N$89
  Bottom 1.93: 75.95,43.6 74.17,43.6 75.82,45
N$90
  Bottom 1.93: 76.2,43.73 76.2,49.82
N$91
  Bottom 1.93: 74.17,54.52 77.85,54.52 77.09,53 74.17,53
N$92
  Top 1.93: 74.68,55.41 74.68,52.36 76.07,53.63 76.07,55.41
N$93
  Top 1.93: 75.31,43.98 79.5,48.43
N$94
  Top 1.93: 74.04,41.44 78.61,41.44 77.6,40.3 74.17,40.3
N$95
  Top 1.93: 77.47,21.5 77.6,24.8
N$96
  Top 1.93: 77.34,21.88 76.07,20.36 82.8,20.36 78.61,21
N$97
  Top 2.54: TP14.P$1 8.13,20.11 8.13,18.2 12.19,18.2 TP14.P$1
  Bottom 0.813: TP14.P$1 10.92,20.11 7.62,23.41 7.62,38.14 5.46,40.3 5.46,60.11 14.73,72.18 94.23,72.3 98.17,68.37 98.17,65.24 X3.25
  Bottom 2.54: TP14.P$1 8.13,20.11 8.13,18.2 12.19,18.2 TP14.P$1
N$98
  Top 2.54: 16,19.09 15.88,19.09 15.88,19.47 16,19.47 | 16,19.47 19.18,19.47 19.18,18.58 16,18.58 16,19.47
N$99
  Bottom 1.016: 66.29,57.44 65.53,57.44 65.53,56.81 66.29,56.81
N$100  (via drill 0.6)  (1 unrouted)
  Top 0.406: 41.91,60.62 40.89,61.13 39.85,61.38
  Top 0.61: 41.91,60.62 41.91,57.83 51.82,47.92
  Top 0.813: 51.82,47.92 51.82,18.96 56.64,7.53 56.9,7.28 | 39.06,62.45 38.18,64 v37.97,64.3 | 39.85,61.38 X2.24
  Top 3.81: 56.9,7.28 TP20_6V.P$1
  Bottom 1.016: 39.19,62.19 v37.97,64.3
  Bottom 3.81: TP20_6V.P$1 57.4,7.28
N$101  (via drill 0.6)
  Top 1.016: v22.61,65.06 22.61,66.97 22.99,67.35
  Bottom 1.016: 22.48,62.27 22.48,64.94 v22.61,65.06
N$102
  Bottom 1.016: 36.2,62.27 36.2,62.78 34.92,64.05
N$103  (via drill 0.6)
  other vias: 34.92,64.17
N$104
  Bottom 1.016: 93.73,59.73 93.73,60.62
N$105
  Top 1.016: 93.85,60.75 93.85,57.95
N$106  (via drill 0.6)
  Bottom 1.016: 91.06,59.86 91.06,57.32 v91.69,56.68
N$107  (via drill 0.6)
  other vias: 83.06,57.44
N$108  (via drill 0.6)
  other vias: 68.58,53.63
N$109
  Bottom 1.016: 68.2,53.63 69.09,53.63
N$110
  Top 1.016: 67.94,53.63 69.22,53.63
N$111  (via drill 0.6)
  other vias: 65.91,57.06
N$112  (via drill 0.6)
  other vias: 63.25,56.55
N$113
  Top 1.016: 63.37,56.68 62.74,56.68 62.74,56.17 63.75,56.17
N$114
  Bottom 1.016: 63.63,56.94 62.61,56.94 62.48,56.81 62.48,56.17 63.5,56.17 63.88,56.55
N$115
  Top 1.016: 66.42,57.57 65.53,57.57 65.41,57.44 65.41,56.81 66.42,56.81
N$116  (via drill 0.6)
  other vias: 11.5,50
N$117  (via drill 0.6)
  other vias: 9,44
N$118  (via drill 0.6)
  other vias: 94.5,4.6
N$144
  Top 1.016: X10.1 99.82,8.4 Q3.B
N$145
  Top 1.016: X10.2 102.36,8.4 Q3.E
N$146
  Top 1.016: Q3.C 103.8,10.92 104.65,10.07 104.65,5.25 X10.3
N$154
  Top 1.016: X13.1 99.82,19.57 Q6.B
N$155
  Top 1.016: X13.2 102.36,20.08 Q6.E
N$156
  Top 1.016: X13.3 104.9,20.74 103.38,22.27 101.43,22.27 Q6.C
N$204
  Top 1.016: X20.1 99.82,33.55 Q9.B
N$205
  Top 1.016: X20.2 102.36,33.55 Q9.E
N$206
  Top 1.016: Q9.C 103.8,36.06 104.65,35.22 104.65,30.39 X20.3
N$214
  Top 1.016: X23.1 99.82,44.72 Q12.B
N$215
  Top 1.016: X23.2 102.36,45.23 Q12.E
N$216
  Top 1.016: X23.3 104.9,45.89 103.38,47.41 101.43,47.41 Q12.C
N$264
  Top 1.016: X30.1 -1.91,8.53 Q15.B
N$265
  Top 1.016: X30.2 0.64,8.53 Q15.E
N$266
  Top 1.016: Q15.C 2.08,11.05 2.92,10.2 2.92,5.37 X30.3
N$274
  Top 1.016: X33.1 -1.91,19.7 Q18.B
N$275
  Top 1.016: X33.2 0.64,20.21 Q18.E
N$276
  Top 1.016: X33.3 3.17,20.87 1.65,22.39 -0.3,22.39 Q18.C
N$324
  Top 1.016: X40.1 -1.91,33.67 Q21.B
N$325
  Top 1.016: X40.2 0.64,33.67 Q21.E
N$326
  Top 1.016: Q21.C 2.08,36.19 2.92,35.35 2.92,30.52 X40.3
N$334
  Top 1.016: X43.1 -1.91,44.85 Q24.B
N$335
  Top 1.016: X43.2 0.64,45.36 Q24.E
N$336
  Top 1.016: X43.3 3.17,46.01 1.65,47.54 -0.3,47.54 Q24.C
WAGO1
  Top 0.508: 63.37,56.81 64.9,55.28 64.9,45.76 63.37,44.11 59.82,40.55 59.82,26.07 72.14,13.76 72.9,9.06 | 74.68,7.28 74.68,6.01 TP1.P$1 | 63.37,59.73 X3.1
  Top 1.016: 63.37,56.81 63.37,59.73 | 74.68,7.28 72.9,9.06
WAGO2
  Top 0.508: 66.17,56.05 66.17,45.76 60.58,40.17 60.58,26.46 74.42,12.61 74.42,9.95 78.74,6.52 | TP2.P$1 83.57,6.64 | 66.17,59.73 X3.2
  Top 1.016: 66.17,56.05 66.17,59.73 | 83.57,6.64 78.74,6.52
WAGO3
  Top 0.508: 68.96,50.2 68.96,47.41 61.34,39.79 61.34,26.84 77.34,10.84 TP3.P$1
  Top 1.016: 68.96,50.2 X3.3
  Bottom 1.016: X3.3 68.96,53.76
WAGO4
  Top 0.508: 71.63,51.09 71.63,48.94 62.1,39.41 62.1,28.11 71.63,18.58 77.85,18.58 | 71.63,59.73 X3.4 | 80.26,16.17 TP4.P$1
  Top 1.016: 71.63,51.09 71.63,59.73 | 80.26,16.17 77.85,18.58
WAGO5  (via drill 0.51)
  Top 0.508: 74.42,59.73 X3.5
  Top 1.016: v75.31,54.27 75.31,55.03 74.42,55.92 74.42,59.73
  Bottom 0.508: 74.42,52.62 74.42,46.27 72.26,44.11 72.26,40.17 70.99,38.9 70.99,34.2 72.26,31.92 72.26,29.12 77.72,23.66 | 77.72,21.63 TP5.P$1
  Bottom 1.016: 74.42,52.62 75.31,53.51 v75.31,54.27 | 77.72,21.63 77.72,23.66
WAGO6
  Bottom 0.508: 76.07,57.57 71.88,57.57 71.25,56.94 71.25,51.6 69.6,49.95 69.6,41.19 62.1,33.7 62.1,29.5 71.12,20.49 74.42,20.49 75.95,18.96 78.36,18.96 80.39,21 | 80.39,23.15 TP6.P$1
  Bottom 1.016: X3.6 77.24,58.74 76.07,57.57 | 80.39,21 80.39,23.15
WAGO7
  Top 1.016: X3.7 80.01,57.44
  Bottom 0.508: 79.88,52.87 77.85,50.84 77.85,40.43 75.69,38.9 73.41,38.9 72.64,38.52 72.64,33.57 73.15,32.68 73.15,30.01 74.23,28.93
  Bottom 1.016: 79.88,52.87 X3.7 | 74.23,28.93 TP7.P$1
WAGO8
  Top 0.508: 80.26,30.27 TP8.P$1 | 82.68,59.73 82.74,59.79 | 82.74,59.79 83.95,61 84.96,61 85.47,61.51 85.47,68.62 98.55,68.62 98.55,58.46 93.85,53.76 90.17,53.76 82.68,46.27 82.68,32.68 | X3.8 82.8,59.73 82.74,59.79
  Top 1.016: 80.26,30.27 82.68,32.68
WAGO9
  Bottom 0.508: 85.47,54.65 79.88,49.32 79.88,39.66 77.22,36.74 77.22,35.73 | 75.56,34.08 74.93,34.08 TP9.P$1 | 85.47,59.73 X3.9
  Bottom 1.016: 85.47,54.65 85.47,59.73 | 75.56,34.08 77.22,35.73
WAGO10
  Bottom 0.508: 88.27,54.65 81.41,47.54 81.41,39.28 | 80.39,36.87 80.39,36.62 TP10.P$1 | 88.27,59.73 X3.10
  Bottom 1.016: 88.27,54.65 88.27,59.73 | 80.39,36.87 81.41,39.28
WAGO11
  Top 0.508: 74.68,40.93 TP11.P$1
  Top 1.016: 91.06,56.68 91.06,56.3 75.69,40.93 74.68,40.93 | 91.06,56.68 X3.11 | 91.95,56.68 91.06,56.68
WAGO13
  Bottom 0.508: 96.52,55.16 93.73,52.36 93.73,33.19 81.03,18.58 79.63,18.58 77.6,16.55 77.6,13.88 | 96.52,59.73 X3.13 | 69.47,5.76 TP12.P$1
  Bottom 1.016: 96.52,55.16 96.52,59.73 | 69.47,5.76 69.85,6.14 77.6,13.88
  Bottom 1.93: 69.85,6.14 67.06,6.14 67.06,4.36 69.85,4.36
WAGO14
  Bottom 0.508: 69.6,9.31 TP16.P$1
  Bottom 0.992: 58.8,18.2 58.8,55.79
  Bottom 1.016: X3.14 63.25,62.27 61.09,60.37 60.96,57.95 58.8,55.79 | 69.6,9.31 58.8,18.2
WAGO15
  Bottom 0.508: 67.56,60.87 67.56,55.28 66.42,54.14 66.42,48.3 59.94,42.59 59.94,24.93 69.47,16.68 | 67.56,62.27 X3.15 | 69.47,12.74 TP17.P$1
  Bottom 1.016: 67.56,60.87 67.56,62.27 | 69.47,12.74 69.47,16.68
WAGO16
  Top 1.016: X3.16 69.85,64.05
  Bottom 0.508: 70.36,61 70.36,52.62 68.45,50.59 68.45,42.08 60.96,34.58 60.96,29.38 72.26,17.69 73.66,16.3 | 75.31,16.3 TP18.P$1
  Bottom 1.016: 70.36,61 X3.16 | 75.31,16.3 73.66,16.3
WAGO17  (via drill 0.6)
  Top 0.508: 59.05,24.04 59.05,59.09 66.42,66.46 v71.25,66.46 | TP19.P$1 64.14,18.96
  Top 1.016: 64.14,18.96 59.05,24.04
  Bottom 0.508: 71.32,66.39 v71.25,66.46
  Bottom 1.016: X3.17 71.32,66.39
WAGO18  (via drill 0.6)
  Top 0.508: 75.82,62.91 73.03,60.11 73.03,49.19 67.18,43.35 67.18,37.63 66.29,36.74 66.29,26.71 69.72,23.28 | 74.93,23.28 TP21.P$1
  Top 1.016: 74.93,23.28 69.72,23.28 | v74.55,65.7 75.82,64.43 75.82,62.91
  Bottom 1.016: X3.18 75.87,64.38 v74.55,65.7
WAGO19  (via drill 0.6)
  Top 0.508: 77.53,61.95 75.82,60.24 75.82,57.83 77.85,56.68 77.85,52.49 68.33,43.35 68.33,37.25 67.18,36.11 67.18,28.49 67.31,28.49 67.94,27.85 | 69.47,26.2 69.47,26.71 TP22.P$1
  Top 1.016: 77.53,61.95 77.85,62.27 79.25,63.67 v79.25,64.94 | 69.47,26.2 67.94,27.85
  Bottom 1.016: X3.19 78.64,64.33 v79.25,64.94
WAGO20  (via drill 0.6)  (1 unrouted)
  Top 0.508: 70.99,32.55 70.99,34.71 70.99,43.6 81.41,54.02 81.41,61.25 | 69.6,31.16 69.6,30.9 TP23.P$1
  Top 1.016: 69.6,31.16 70.99,32.55 | v82.42,64.94 81.41,63.92 81.41,61.25
  Top 1.422: 70.99,30.14 70.99,34.71
  Bottom 1.016: 81.41,62.27 81.41,63.92 v82.42,64.94
WAGO21
  Bottom 0.508: 83.19,62.27 81.92,61 80.64,61 80.52,61.13 79.5,61.13 78.61,60.24 78.61,56.3 72.39,56.3 72.39,51.22 70.99,49.82 70.99,40.55 68.71,38.27 68.71,37.38 | 64.39,32.81 TP24.P$1
  Bottom 1.016: 83.19,62.27 X3.21 | 64.39,32.81 65.28,33.95 68.71,37.38
WAGO22  (via drill 0.6)
  Top 0.508: 72.26,39.41 72.26,43.73 86.87,58.33 86.87,61.13 86.87,63.67 | 74.93,36.74 TP25.P$1
  Top 1.016: 74.93,36.74 72.26,39.41 | v88.01,64.81 86.87,63.67
  Bottom 1.016: X3.22 86.92,63.72 v88.01,64.81
WAGO23
  Top 1.016: X3.23 90.04,64.05
  Bottom 0.508: 89.66,60.87 89.66,53.25 82.68,46.27 82.68,35.6 78.49,31.41 | TP26.P$1 75.31,31.41
  Bottom 1.016: 89.66,60.87 X3.23 | 75.31,31.41 78.49,31.41
WAGO24  (via drill 0.6)
  Top 0.508: 91.19,61.76 89.66,60.24 89.66,58.71 | TP13.P$1 75.69,44.74
  Top 1.016: 91.19,61.76 92.46,63.03 92.46,65.06 v94.11,66.72 | 75.69,44.74 89.66,58.71
  Bottom 1.016: X3.24 92.43,65.04 v94.11,66.72
(copper drawn outside any net)
  shapes: Bottom circle x5, Top circle x6

### Text on the board
Top: Top
Bottom: Bottom
bPlace: 4 | 3 | 2 | 1 | b | c | 5 | a | 5 | 4 | 3 | 1 | 2
tNames: GND c b a 12V | 10V | GND / BT / HiB | RPM | RPM / SPD / HiB | 18 | 19< | 2.7 / 2.6 | Start | 1.12 GND / 1.11< / 1.10<> / 1.9 > / 1.8 N / 1.7 G5 / 1.6 _G4 / 1.5 G3 / 1.4 G2 / 1.3 G1 | 6V | 1.2 CC | BT / ABS / BAR / ALT / TMP / OIL / CHK / SWP | 1.1 BAT | 1BAT / 2 GC / 3 GB / 4 GA / / 6SWP / 7 RES / 8 ABS / 9 ALT / 10 TMP / OIL | 2.12 / 2.11 / 2.10 / 2.9 / / / / 2.5 / 2.4 / 2.3 / 2.2 / 2.1 | 13 / 14 / 15 / 16 / 17> / / / / 21 SPDin / 22 SPDout / 23 / 24
bNames: 78L10 | N | N | < / / > / / G5 / / G3 / / G1 / / / BAT | GND / / <> / / N / / G4 / / G2 / / CC
tValues: set jumper for / motoscope tiny / support
bValues: BA | BA | 6,8 | 2.4V/1.1V | 4 | 13 GND / 14 BT / 15 HiB / 16 RPM / 17 > / 18 GND / 19 < / / 21 SPD in / 22 SPD o / 23 GND | SPD / / WRN / / ABS / / ALT / / OIL / / SWP | RPM / / HiB / / BT / / BAR / / TMP / / CHK | BA | BA | 1 BAT / 2 GC / 3 GB / 4 GA / 5 START / 6 SWP / 7R ES / 8A BS / 9 / 10 TMP / 11 OIL / 12CH K